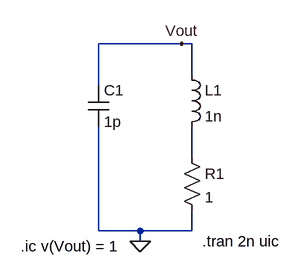
[diagram p0: schematic LC_circuit_3_FIGURE6.asc]
LC_circuit_3_FIGURE6.asc, the LTspice schematic file:
Version 4
SHEET 1 880 680
WIRE 256 64 128 64
WIRE 272 64 256 64
WIRE 272 112 272 64
WIRE 128 128 128 64
WIRE 272 240 272 192
WIRE 128 352 128 192
WIRE 192 352 128 352
WIRE 272 352 272 320
WIRE 272 352 192 352
WIRE 192 368 192 352
FLAG 192 368 0
FLAG 256 64 Vout
SYMBOL ind 256 96 R0
SYMATTR InstName L1
SYMATTR Value 1n
SYMATTR SpiceLine Rser=0
SYMBOL cap 112 128 R0
SYMATTR InstName C1
SYMATTR Value 1p
SYMBOL res 256 224 R0
SYMATTR InstName R1
SYMATTR Value 1
TEXT 288 368 Left 2 !.tran 2n uic
TEXT 8 376 Left 2 !.ic v(Vout) = 1

The netlist it stands for:
* LC_circuit_3_FIGURE6.asc
L1 Vout N001 1n Rser=0
C1 Vout 0 1p
R1 N001 0 1
.tran 2n uic
.ic v(Vout) = 1
.backanno
.end